# EAGLE schematic Energiezelle (EAGLE 6.4)
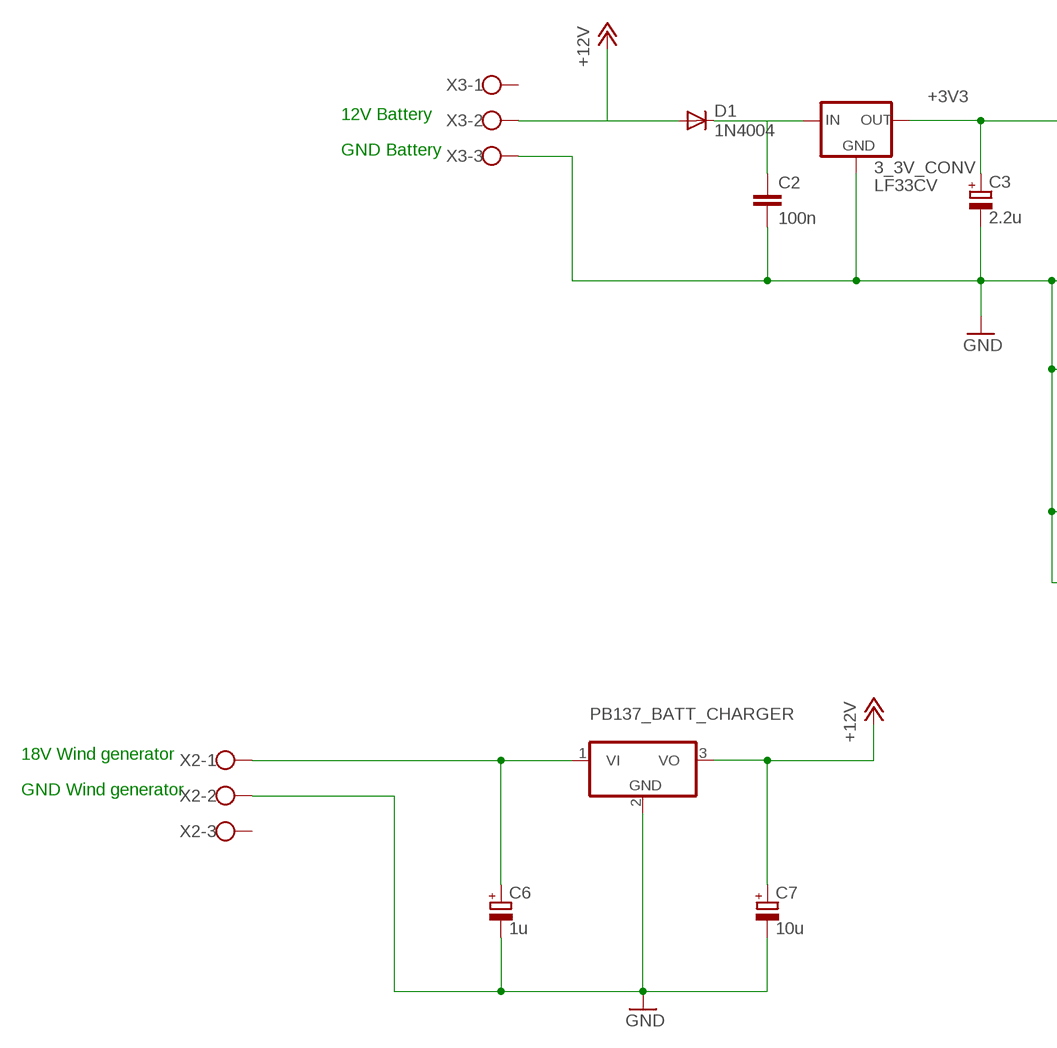
[diagram p0: schematic, sheet 1, part 1 of 2]
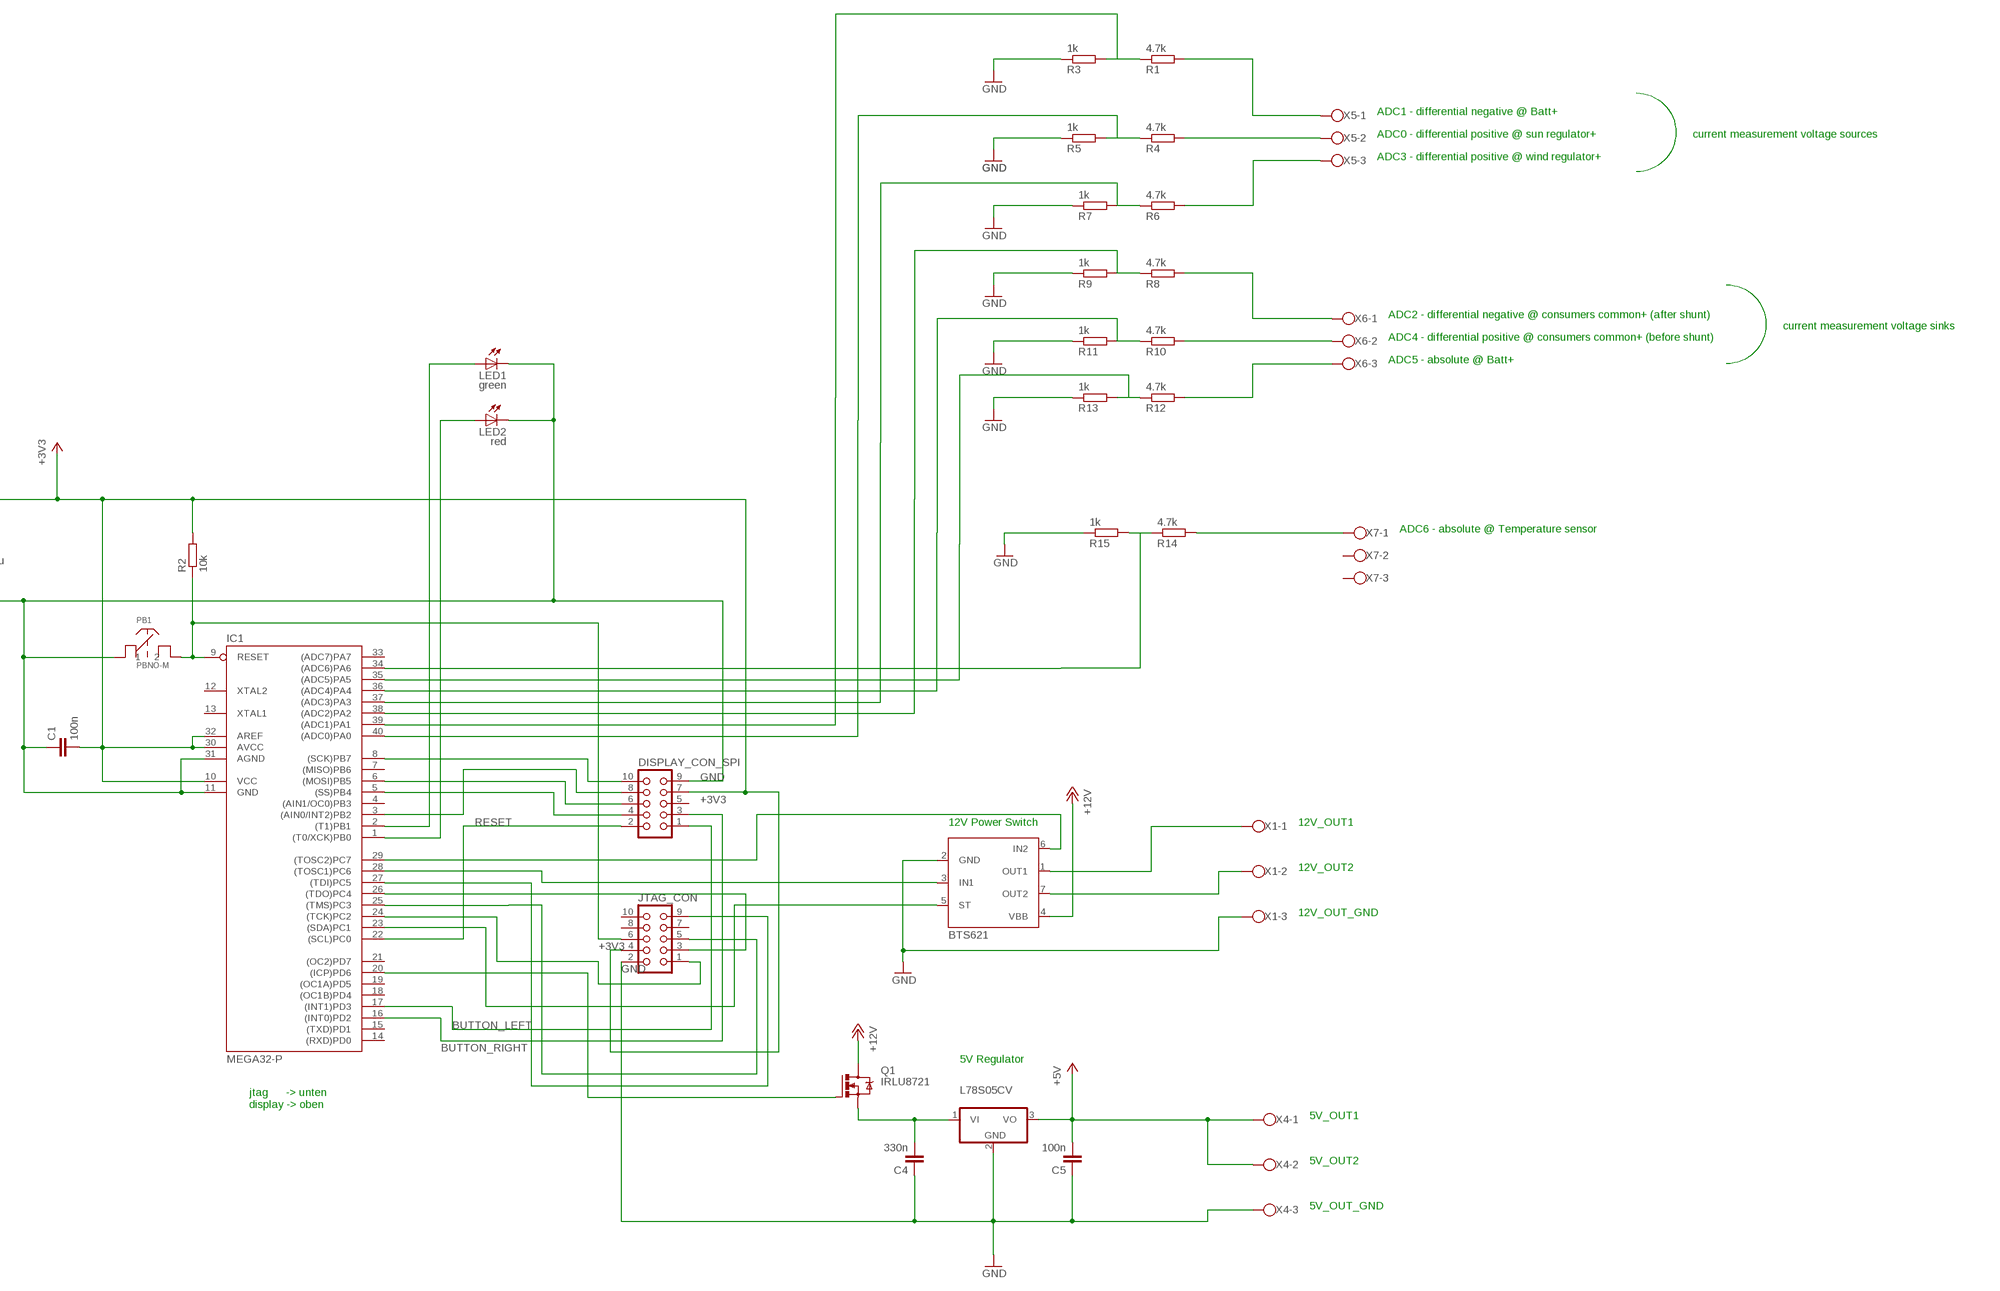
[diagram p1: schematic, sheet 1, part 2 of 2]

## Parts
3_3V_CONV  LF33CV  LFXXCVS  [TO220S]
C1  100n  C-EU050-024X044  [C050-024X044]
C2  100n  C-EU050-024X044  [C050-024X044]
C3  2.2u  CPOL-EUE2,5-6E  [E2,5-6E]
C4  330n  C-EU050-024X044  [C050-024X044]
C5  100n  C-EU050-024X044  [C050-024X044]
C6  1u  CPOL-EUE2,5-6E  [E2,5-6E]
C7  10u  CPOL-EUE2,5-6E  [E2,5-6E]
D1  1N4004  [DO41-10]
DISPLAY_CON_SPI  CON10L  [CON10L]
IC1  MEGA32-P  [DIL40]
IC2  BTS621  TLE5205-2  [P-TO220-7-11]
JTAG_CON  CON10L  [CON10L]
L78S05CV  788TV  [TO220V]
LED1  green  LEDLSU260  [LSU260]
LED2  red  LEDLSU260  [LSU260]
PB1  PBNO-M  [PBNO-M]
PB137_BATT_CHARGER  788TV  [TO220V]
Q1  IRLU8721  IRF540  [TO220BV]
R1  4.7k  R-EU_0207/10  [0207/10]
R2  10k  R-EU_0207/10  [0207/10]
R3  1k  R-EU_0207/10  [0207/10]
R4  4.7k  R-EU_0207/10  [0207/10]
R5  1k  R-EU_0207/10  [0207/10]
R6  4.7k  R-EU_0207/10  [0207/10]
R7  1k  R-EU_0207/10  [0207/10]
R8  4.7k  R-EU_0207/10  [0207/10]
R9  1k  R-EU_0207/10  [0207/10]
R10  4.7k  R-EU_0207/10  [0207/10]
R11  1k  R-EU_0207/10  [0207/10]
R12  4.7k  R-EU_0207/10  [0207/10]
R13  1k  R-EU_0207/10  [0207/10]
R14  4.7k  R-EU_0207/10  [0207/10]
R15  1k  R-EU_0207/10  [0207/10]
X1  W237-103  [W237-103]
X2  W237-103  [W237-103]
X3  W237-103  [W237-103]
X4  W237-103  [W237-103]
X5  W237-103  [W237-103]
X6  W237-103  [W237-103]
X7  W237-103  [W237-103]

## Nets
+3V3: 3_3V_CONV.3(OUT) C1.2 C3.+ DISPLAY_CON_SPI.7 IC1.10(VCC) IC1.30(AVCC) IC1.32(AREF) JTAG_CON.4 R2.2
+5V: C5.2 L78S05CV.3(VO) X4.1 X4.2
+12V: C7.+ D1.A IC2.4(VBB) PB137_BATT_CHARGER.3(VO) Q1.D X3.2
BUTTON_LEFT: DISPLAY_CON_SPI.1 IC1.17((INT1)PD3)
BUTTON_RIGHT: DISPLAY_CON_SPI.3 IC1.16((INT0)PD2)
GND: 3_3V_CONV.2(GND) C1.1 C2.2 C3.- C4.1 C5.1 C6.- C7.- DISPLAY_CON_SPI.9 IC1.11(GND) IC1.31(AGND) IC2.2(GND) JTAG_CON.2 L78S05CV.2(GND) LED1.K(C) LED2.K(C) PB1.P$1 PB137_BATT_CHARGER.2(GND) R3.1 R5.1 R7.1 R9.1 R11.1 R13.1 R15.1 X1.3 X2.2 X3.3 X4.3
N$1: IC1.28((TOSC1)PC6) IC2.3(IN1)
N$2: IC1.29((TOSC2)PC7) IC2.6(IN2)
N$3: IC1.23((SDA)PC1) IC2.5(ST)
N$4: R1.2 X5.1
N$5: DISPLAY_CON_SPI.10 IC1.8((SCK)PB7)
N$6: DISPLAY_CON_SPI.8 IC1.3((AIN0/INT2)PB2)
N$7: DISPLAY_CON_SPI.6 IC1.6((MOSI)PB5)
N$8: DISPLAY_CON_SPI.4 IC1.5((SS)PB4)
N$9: IC2.1(OUT1) X1.1
N$10: IC2.7(OUT2) X1.2
N$11: C6.+ PB137_BATT_CHARGER.1(VI) X2.1
N$12: IC1.27((TDI)PC5) JTAG_CON.9
N$13: IC1.26((TDO)PC4) JTAG_CON.3
N$14: IC1.25((TMS)PC3) JTAG_CON.5
N$15: IC1.24((TCK)PC2) JTAG_CON.1
N$16: R4.2 X5.2
N$17: R6.2 X5.3
N$18: R8.2 X6.1
N$20: R10.2 X6.2
N$21: R12.2 X6.3
N$22: IC1.34((ADC6)PA6) R14.1 R15.2
N$24: IC1.1((T0/XCK)PB0) LED2.A
N$25: IC1.2((T1)PB1) LED1.A
N$26: C4.2 L78S05CV.1(VI) Q1.S
N$27: 3_3V_CONV.1(IN) C2.1 D1.C
N$28: IC1.20((ICP)PD6) Q1.G
N$29: IC1.9(RESET) JTAG_CON.6 PB1.P$2 R2.1
N$30: IC1.39((ADC1)PA1) R1.1 R3.2
N$31: IC1.40((ADC0)PA0) R4.1 R5.2
N$32: IC1.37((ADC3)PA3) R6.1 R7.2
N$33: IC1.38((ADC2)PA2) R8.1 R9.2
N$34: IC1.36((ADC4)PA4) R10.1 R11.2
N$35: IC1.35((ADC5)PA5) R12.1 R13.2
N$36: R14.2 X7.1
RESET: DISPLAY_CON_SPI.2 IC1.22((SCL)PC0)
Unconnected: DISPLAY_CON_SPI.5 IC1.4((AIN1/OC0)PB3) IC1.7((MISO)PB6) IC1.12(XTAL2) IC1.13(XTAL1) IC1.14((RXD)PD0) IC1.15((TXD)PD1) IC1.18((OC1B)PD4) IC1.19((OC1A)PD5) IC1.21((OC2)PD7) IC1.33((ADC7)PA7) JTAG_CON.7 JTAG_CON.8 JTAG_CON.10 X2.3 X3.1 X7.2 X7.3

## Notes on the sheet
- ADC1 - differential negative @ Batt+
- ADC0 - differential positive @ sun regulator+ | current measurement voltage sources
- ADC3 - differential positive @ wind regulator+
- ADC2 - differential negative @ consumers common+ (after shunt)
- current measurement voltage sinks
- ADC4 - differential positive @ consumers common+ (before shunt)
- ADC5 - absolute @ Batt+
- 12V Battery
- GND Battery
- ADC6 - absolute @ Temperature sensor
- 12V Power Switch | 12V_OUT1
- 12V_OUT2
- 18V Wind generator
- 12V_OUT_GND
- GND Wind generator
- 5V Regulator
- jtag      -> unten
  display -> oben
- 5V_OUT1
- 5V_OUT2
- 5V_OUT_GND

## Library data of the parts
3_3V_CONV = lf33:LFXXCV: VOLTAGE REGULATOR
C1 C2 C4 C5 = resistor:C-EU: CAPACITOR, European symbol
C3 C6 C7 = rcl:CPOL-EU: POLARIZED CAPACITOR, European symbol
D1 = diode:1N4004: DIODE general purpose rectifier, 1 A
DISPLAY_CON_SPI JTAG_CON = con-harting:CON10L: CONNECTOR; OC_FARNELL: unknown; OC_NEWARK: unknown
IC1 = avr-7:MEGA32-P: MICROCONTROLLER 32 Kbytes FLASH 2 Kbytes SRAM 1 Kbytes EEPROM USART 8-channel 10 bit ADC
IC2 = infineon:TLE5205-2: 5-A H-Bridge for DC-Motor Applications Source: http://www.infineon.com .. tle5205-2.pdf; OC_FARNELL: unknown; OC_NEWARK: unknown
L78S05CV PB137_BATT_CHARGER = linear:78*: Positive VOLTAGE REGULATOR Source: http://cache.national.com/ds/LM/LM78L05.pdf http://www.fairchildsemi.com/ds/LM/LM7805.pdf
LED1 LED2 = led:LED: LED OSRAM: - CHIPLED LG R971, LG N971, LY N971, LG Q971, LY Q971, LO R971, LY R971 LH N974, LH R974 LS Q976, LO Q976, LY Q976 LO Q996 - Hyper CHIPLED LW Q18S LB Q993, LB Q99A, LB R99A - SideLED LS A670, LO A670, LY A670, LG A670, LP A670 LB A673, LV A673, LT A673, LW A673 LH A674 LY A675 LS A676, LA A676, LO A676, LY A676, LW A676 LS A679, LY A679, LG A679 - Hyper Micro SIDELED® LS Y876, LA Y876, LO Y876, LY Y876 LT Y87S - SmartLED LW L88C, LW L88S LB L89C, LB L89S, LG L890 LS L89K, LO L89K, LY L89K LS L896, LA L896, LO L896, LY L896 - TOPLED LS T670, LO T670, LY T670, LG T670, LP T670 LSG T670, LSP T670, LSY T670, LOP T670, LYG T670 LG T671, LOG T671, LSG T671 LB T673, LV T673, LT T673, LW T673 LH T674 LS T676, LA T676, LO T676, LY T676, LB T676, LH T676, LSB T676, LW T676 LB T67C, LV T67C, LT T67C, LS T67K, LO T67K, LY T67K, LW E67C LS E67B, LA E67B, LO E67B, LY E67B, LB E67C, LV E67C, LT E67C LW T67C LS T679, LY T679, LG T679 LS T770, LO T770, LY T770, LG T770, LP T770 LB T773, LV T773, LT T773, LW T773 LH T774 LS E675, LA E675, LY E675, LS T675 LS T776, LA T776, LO T776, LY T776, LB T776 LHGB T686 LT T68C, LB T68C - Hyper Mini TOPLED® LB M676 - Mini TOPLED Santana® LG M470 LS M47K, LO M47K, LY M47K Source: http://www.osram.convergy.de LUXEON: - LUMILED® LXK2-PW12-R00, LXK2-PW12-S00, LXK2-PW14-U00, LXK2-PW14-V00 LXK2-PM12-R00, LXK2-PM12-S00, LXK2-PM14-U00 LXK2-PE12-Q00, LXK2-PE12-R00, LXK2-PE12-S00, LXK2-PE14-T00, LXK2-PE14-U00 LXK2-PB12-K00, LXK2-PB12-L00, LXK2-PB12-M00, LXK2-PB14-N00, LXK2-PB14-P00, LXK2-PB14-Q00 LXK2-PR12-L00, LXK2-PR12-M00, LXK2-PR14-Q00, LXK2-PR14-R00 LXK2-PD12-Q00, LXK2-PD12-R00, LXK2-PD12-S00 LXK2-PH12-R00, LXK2-PH12-S00 LXK2-PL12-P00, LXK2-PL12-Q00, LXK2-PL12-R00 Source: www.luxeon.com KINGBRIGHT: KA-3528ASYC Source: www.kingbright.com
PB1 = pushbuttons2:PBNO-M
Q1 = transistor-power:IRF540: HEXFET Power MOSFET
R1-R15 = resistor:R-EU_: RESISTOR, European symbol
X1-X7 = con-wago-500:W237-103: WAGO SCREW CLAMP; MPN: 237-103; OC_FARNELL: unknown; OC_NEWARK: 18M7116